# Altium project V2_wearable.PrjPcb
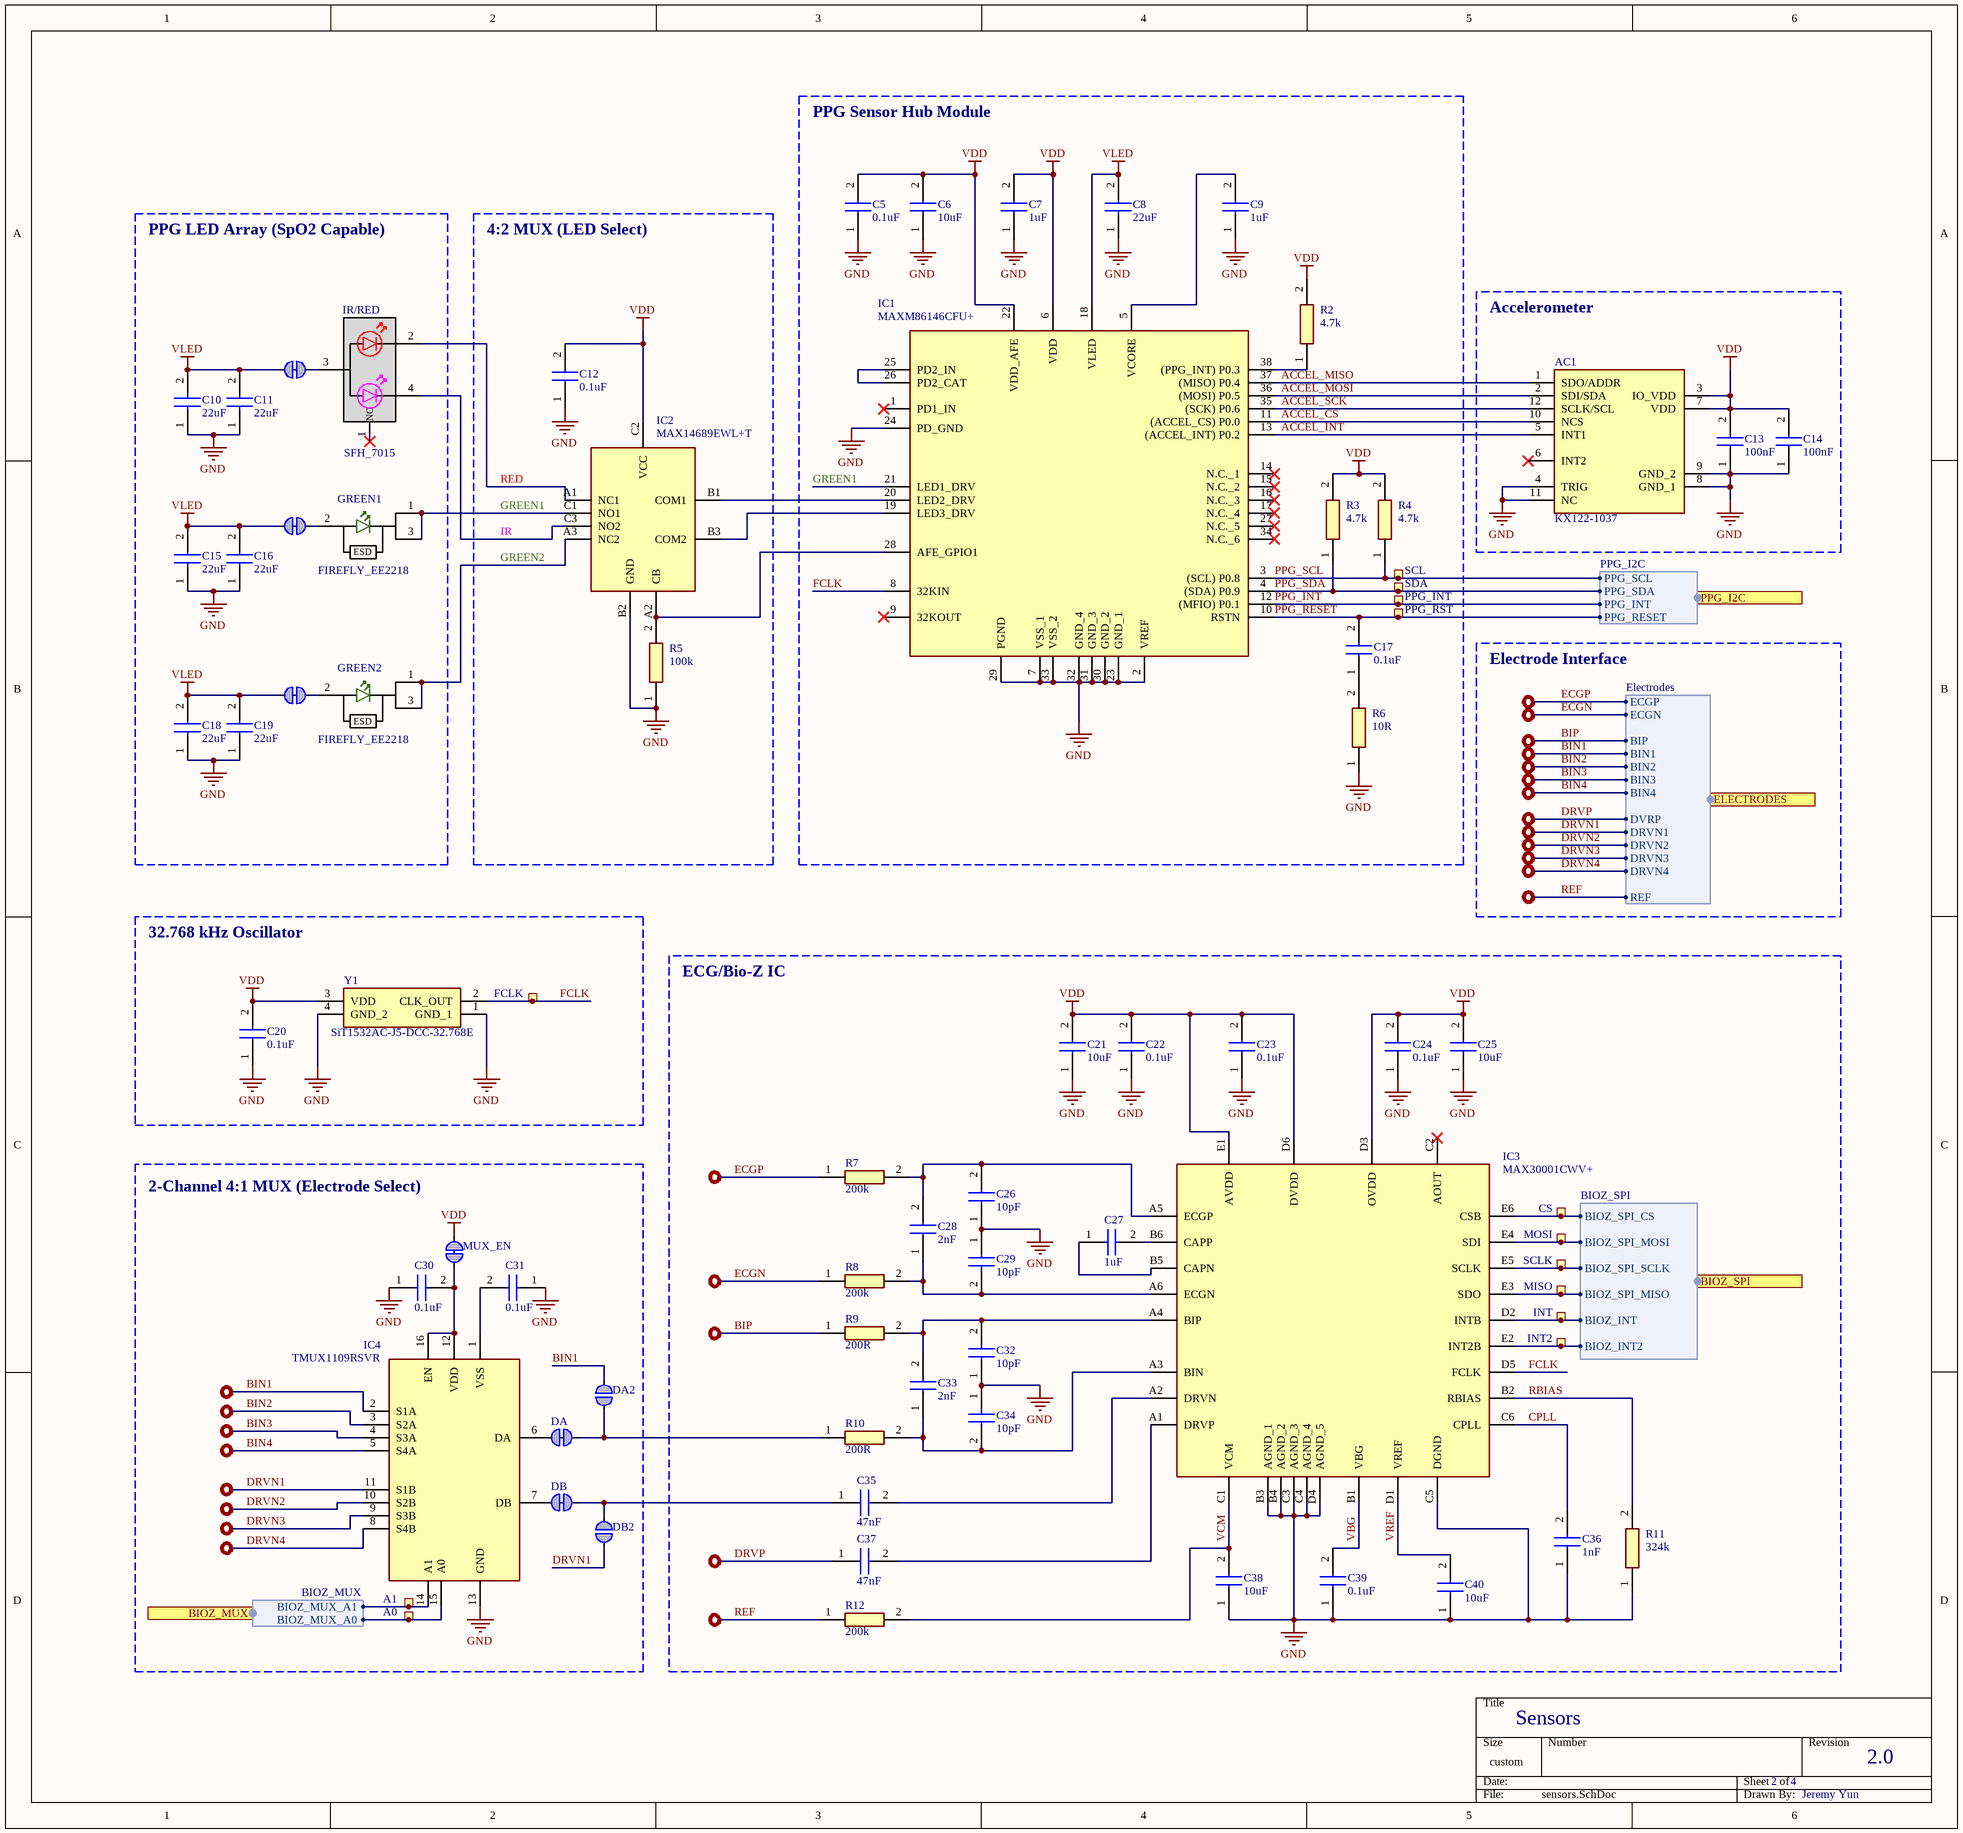
[diagram p0: sensors.SchDoc]
2 sheets, 107 parts. Net scope: flat (ports and power ports of the same name join across sheets).
Board file: ipg_wearable.PcbDoc
Sheets:
  sensors.SchDoc
  power_supply.SchDoc

## Sheet sensors.SchDoc
size 381 x 355 mm; SheetNumber: 2; SheetTotal: 4

### Parts
A0  Ø1.0mm,SMD  [TP_SMD_D1.0mm]  (value not drawn)  (no BOM)
A1  Ø1.0mm,SMD  [TP_SMD_D1.0mm]  (value not drawn)  (no BOM)
AC1  KX122-1037  [KX1221037]
C5  0.1uF  [CAPC1005X55N]
C6  10uF  [CAPC1005X55N]
C7  1uF  [CAPC1005X55N]
C8  22uF  [CAPC1005X55N]
C9  1uF  [CAPC1005X55N]
C10  22uF  [CAPC1005X55N]
C11  22uF  [CAPC1005X55N]
C12  0.1uF  [CAPC1005X55N]
C13  100nF  [CAPC1005X55N]
C14  100nF  [CAPC1005X55N]
C15  22uF  [CAPC1005X55N]
C16  22uF  [CAPC1005X55N]
C17  0.1uF  [CAPC1005X55N]
C18  22uF  [CAPC1005X55N]
C19  22uF  [CAPC1005X55N]
C20  0.1uF  [CAPC1005X55N]
C21  10uF  [CAPC1005X55N]
C22  0.1uF  [CAPC1005X55N]
C23  0.1uF  [CAPC1005X55N]
C24  0.1uF  [CAPC1005X55N]
C25  10uF  [CAPC1005X55N]
C26  10pF  [CAPC0603X33N]
C27  1uF  [CAPC1005X55N]
C28  2nF  [C0603]
C29  10pF  [CAPC0603X33N]
C30  0.1uF  [CAPC1005X55N]
C31  0.1uF  [CAPC1005X55N]
C32  10pF  [CAPC0603X33N]
C33  2nF  [C0603]
C34  10pF  [CAPC0603X33N]
C35  47nF  [CAPC2012X140N]
C36  1nF  [C0402]
C37  47nF  [CAPC2012X140N]
C38  10uF  [CAPC1005X55N]
C39  0.1uF  [CAPC1005X55N]
C40  10uF  [CAPC1005X55N]
CS  Ø1.0mm,SMD  [TP_SMD_D1.0mm]  (value not drawn)  (no BOM)
DA  Solderbridge  [Solderbridge_Shorted]  (value not drawn)  (net tie, no BOM)
DA2  Solderbridge  [Solderbridge]  (value not drawn)  (no BOM)
DB  Solderbridge  [Solderbridge_Shorted]  (value not drawn)  (net tie, no BOM)
DB2  Solderbridge  [Solderbridge]  (value not drawn)  (no BOM)
FCLK  Ø1.0mm,SMD  [TP_SMD_D1.0mm]  (value not drawn)  (no BOM)
GR1  Solderbridge  [Solderbridge_Shorted]  (value not drawn)  (net tie, no BOM)
GR2  Solderbridge  [Solderbridge_Shorted]  (value not drawn)  (net tie, no BOM)
GREEN1  FIREFLY_EE2218  [CTDBLP31126C5D56J6U620R18]
GREEN2  FIREFLY_EE2218  [CTDBLP31126C5D56J6U620R18]
IC1  MAXM86146CFU+  [MAXM86146CFU]
IC2  MAX14689EWL+T  [BGA9C40P3X3_124X124X69]
IC3  MAX30001CWV+  [BGA30C50P6X5_293X274X69]
IC4  TMUX1109RSVR  [TMUX1109RSVR]
INT  Ø1.0mm,SMD  [TP_SMD_D1.0mm]  (value not drawn)  (no BOM)
INT2  Ø1.0mm,SMD  [TP_SMD_D1.0mm]  (value not drawn)  (no BOM)
IR/RED  SFH_7015  [SFH7015]
MISO  Ø1.0mm,SMD  [TP_SMD_D1.0mm]  (value not drawn)  (no BOM)
MOSI  Ø1.0mm,SMD  [TP_SMD_D1.0mm]  (value not drawn)  (no BOM)
MUX_EN  Solderbridge  [Solderbridge_Shorted]  (value not drawn)  (net tie, no BOM)
PPG_INT  Ø1.0mm,SMD  [TP_SMD_D1.0mm]  (value not drawn)  (no BOM)
PPG_RST  Ø1.0mm,SMD  [TP_SMD_D1.0mm]  (value not drawn)  (no BOM)
R2  4.7k  [RESC1005X40N]
R3  4.7k  [RESC1005X40N]
R4  4.7k  [RESC1005X40N]
R5  100k  [RESC1005X40N]
R6  10R  [RESC1005X40N]
R7  200k  [ERJ2RKD1004X]
R8  200k  [ERJ2RKD1004X]
R9  200R  [ERJ2RKD1004X]
R10  200R  [ERJ2RKD1004X]
R11  324k  [RESC1608X55N]
R12  200k  [ERJ2RKD1004X]
RED/IR  Solderbridge  [Solderbridge_Shorted]  (value not drawn)  (net tie, no BOM)
SCL  Ø1.0mm,SMD  [TP_SMD_D1.0mm]  (value not drawn)  (no BOM)
SCLK  Ø1.0mm,SMD  [TP_SMD_D1.0mm]  (value not drawn)  (no BOM)
SDA  Ø1.0mm,SMD  [TP_SMD_D1.0mm]  (value not drawn)  (no BOM)
Y1  SiT1532AC-J5-DCC-32.768E  [SiT1532ACJ5DCC32768E]

### Blocks framed on the sheet
PPG Sensor Hub Module: C5-C9 C17 IC1 PPG_INT PPG_RST R2-R4 R6 SCL SDA
PPG LED Array (SpO2 Capable): C10 C11 C15 C16 C18 C19 GR1 GR2 GREEN1 GREEN2 IR/RED RED/IR
4:2 MUX (LED Select): C12 IC2 R5
Accelerometer: AC1 C13 C14
32.768 kHz Oscillator: C20 FCLK Y1
ECG/Bio-Z IC: C21-C29 C32-C40 CS IC3 INT INT2 MISO MOSI R7-R12 SCLK
2-Channel 4:1 MUX (Electrode Select): A0 A1 C30 C31 DA DA2 DB DB2 IC4 MUX_EN

### Ports
BIOZ_MUX (harness BIOZ_MUX), BIOZ_SPI (harness BIOZ_SPI), ELECTRODES (harness Electrodes), PPG_I2C (harness PPG_I2C)

### Harnesses
Electrodes: ECGP, ECGN, BIN1, BIP, BIN2, BIN3, BIN4, DVRP, DRVN1, DRVN3, DRVN2, DRVN4, REF
BIOZ_SPI: BIOZ_SPI_CS, BIOZ_SPI_MOSI, BIOZ_SPI_MISO, BIOZ_SPI_SCLK, BIOZ_INT, BIOZ_INT2
PPG_I2C: PPG_SCL, PPG_SDA, PPG_INT, PPG_RESET
BIOZ_MUX: BIOZ_MUX_A0, BIOZ_MUX_A1

### Nets
GND: AC1.4(TRIG) AC1.8(GND_1) AC1.9(GND_2) AC1.11(NC) C5.1 C6.1 C7.1 C8.1 C9.1 C10.1 C11.1 C12.1 C13.1 C14.1 C15.1 C16.1 C18.1 C19.1 C20.1 C21.1 C22.1 C23.1 C24.1 C25.1 C26.1 C29.1 C30.1 C31.1 C32.1 C34.1 C36.1 C38.1 C39.1 C40.1 IC1.2(VREF) IC1.7(VSS_1) IC1.23(GND_1) IC1.24(PD_GND) IC1.29(PGND) IC1.30(GND_2) IC1.31(GND_3) IC1.32(GND_4) IC1.33(VSS_2) IC2.B2(GND) IC3.B3(AGND_1) IC3.B4(AGND_2) IC3.C3(AGND_3) IC3.C4(AGND_4) IC3.C5(DGND) IC3.D4(AGND_5) IC4.13(GND) R5.1 R6.1 R11.1 Y1.1(GND_1) Y1.4(GND_2)
VDD: AC1.3(IO_VDD) AC1.7(VDD) C5.2 C6.2 C7.2 C12.2 C13.2 C14.2 C20.2 C21.2 C22.2 C23.2 C24.2 C25.2 IC1.6(VDD) IC1.22(VDD_AFE) IC2.C2(VCC) IC3.D3(OVDD) IC3.D6(DVDD) IC3.E1(AVDD) MUX_EN.1 R2.2 R3.2 R4.2 Y1.3(VDD)
VLED: C8.2 C10.2 C11.2 C15.2 C16.2 C18.2 C19.2 GR1.1 GR2.1 IC1.18(VLED) RED/IR.1
ACCEL_CS: AC1.10(NCS) IC1.11((ACCEL_CS)_P0.0)
ACCEL_INT: AC1.5(INT1) IC1.13((ACCEL_INT)_P0.2)
ACCEL_MISO: AC1.1(SDO/ADDR) IC1.37((MISO)_P0.4)
ACCEL_MOSI: AC1.2(SDI/SDA) IC1.36((MOSI)_P0.5)
ACCEL_SCK: AC1.12(SCLK/SCL) IC1.35((SCK)_P0.6)
BIN1: DA2.1 IC4.2(S1A) ; port ELECTRODES.BIN1
BIN2: IC4.3(S2A) ; port ELECTRODES.BIN2
BIN3: IC4.4(S3A) ; port ELECTRODES.BIN3
BIN4: IC4.5(S4A) ; port ELECTRODES.BIN4
BIP: R9.1 ; port ELECTRODES.BIP
CPLL: C36.2 IC3.C6(CPLL)
DRVN1: DB2.2 IC4.11(S1B) ; port ELECTRODES.DRVN1
DRVN2: IC4.10(S2B) ; port ELECTRODES.DRVN2
DRVN3: IC4.9(S3B) ; port ELECTRODES.DRVN3
DRVN4: IC4.8(S4B) ; port ELECTRODES.DRVN4
DRVP: C37.1 ; port ELECTRODES.DVRP
ECGN: R8.1 ; port ELECTRODES.ECGN
ECGP: R7.1 ; port ELECTRODES.ECGP
FCLK: FCLK.1 IC1.8(32KIN) IC3.D5(FCLK) Y1.2(CLK_OUT)
GREEN1: GREEN1.1(K_1) GREEN1.3(K_2) IC1.21(LED1_DRV) IC2.C1(NO1)
GREEN2: GREEN2.1(K_1) GREEN2.3(K_2) IC2.A3(NC2)
IR: IC2.C3(NO2) IR/RED.4(CATHODE_EMITTER_2_(940_NM))
PPG_INT: IC1.12((MFIO)_P0.1) PPG_INT.1 ; port PPG_I2C.PPG_INT
PPG_RESET: C17.2 IC1.10(RSTN) PPG_RST.1 ; port PPG_I2C.PPG_RESET
PPG_SCL: IC1.3((SCL)_P0.8) R4.1 SCL.1 ; port PPG_I2C.PPG_SCL
PPG_SDA: IC1.4((SDA)_P0.9) R3.1 SDA.1 ; port PPG_I2C.PPG_SDA
RBIAS: IC3.B2(RBIAS) R11.2
RED: IC2.A1(NC1) IR/RED.2(CATHODE_EMITTER_1_(655_NM))
REF: R12.1 ; port ELECTRODES.REF
VBG: C39.2 IC3.B1(VBG)
VCM: C38.2 IC3.C1(VCM) R12.2
VREF: C40.2 IC3.D1(VREF)
NetA0_1: A0.1 IC4.15(A0) ; port BIOZ_MUX.BIOZ_MUX_A0
NetA1_1: A1.1 IC4.14(A1) ; port BIOZ_MUX.BIOZ_MUX_A1
NetC9_2: C9.2 IC1.5(VCORE)
NetC17_1: C17.1 R6.2
NetC26_2: C26.2 C28.2 IC3.A5(ECGP) R7.2
NetC27_1: C27.1 IC3.B5(CAPN)
NetC27_2: C27.2 IC3.B6(CAPP)
NetC28_1: C28.1 C29.2 IC3.A6(ECGN) R8.2
NetC30_2: C30.2 IC4.12(VDD) IC4.16(EN) MUX_EN.2
NetC31_2: C31.2 IC4.1(VSS)
NetC32_2: C32.2 C33.2 IC3.A4(BIP) R9.2
NetC33_1: C33.1 C34.2 IC3.A3(BIN) R10.2
NetC35_1: C35.1 DB.1 DB2.1
NetC35_2: C35.2 IC3.A2(DRVN)
NetC37_2: C37.2 IC3.A1(DRVP)
NetCS_1: CS.1 IC3.E6(CSB) ; port BIOZ_SPI.BIOZ_SPI_CS
NetDA_1: DA.1 DA2.2 R10.1
NetDA_2: DA.2 IC4.6(DA)
NetDB_2: DB.2 IC4.7(DB)
NetGR1_2: GR1.2 GREEN1.2(A)
NetGR2_2: GR2.2 GREEN2.2(A)
NetIC1_19: IC1.19(LED3_DRV) IC2.B3(COM2)
NetIC1_20: IC1.20(LED2_DRV) IC2.B1(COM1)
NetIC1_25: IC1.25(PD2_IN) IC1.26(PD2_CAT)
NetIC1_28: IC1.28(AFE_GPIO1) IC2.A2(CB) R5.2
NetIC1_38: IC1.38((PPG_INT)_P0.3) R2.1
NetIC3_D2: IC3.D2(INTB) INT.1 ; port BIOZ_SPI.BIOZ_INT
NetIC3_E2: IC3.E2(INT2B) INT2.1 ; port BIOZ_SPI.BIOZ_INT2
NetIC3_E3: IC3.E3(SDO) MISO.1 ; port BIOZ_SPI.BIOZ_SPI_MISO
NetIC3_E4: IC3.E4(SDI) MOSI.1 ; port BIOZ_SPI.BIOZ_SPI_MOSI
NetIC3_E5: IC3.E5(SCLK) SCLK.1 ; port BIOZ_SPI.BIOZ_SPI_SCLK
NetIR/RED_3: IR/RED.3(A) RED/IR.2

Not connected (* = marked no-connect by the designer): AC1 6(INT2)*; IC1 1(PD1_IN)* 9(32KOUT)* 14(N.C._1)* 15(N.C._2)* 16(N.C._3)* 17(N.C._4)* 27(N.C._5)* 34(N.C._6)*; IC3 C2(AOUT)*; IR/RED 1(NC)*

### Notes on the sheet
- Electrode Interface
- Sensors
- 2
- 4
- 2.0
- Jeremy Yun
- (in symbol CT_DBLP31.12-6C5D-56-J6U6-20-R18) ESD

### Library data of the parts
A0 A1 CS FCLK INT INT2 MISO MOSI PPG_INT PPG_RST SCL SCLK SDA = TP_SMD_Ø1.0MM: 1.0mm circular SMD testpad; Manufacturer: Nordic Semiconductor; Manufacturer Part Number: N.A.; Pad Count: 1; Part Number: TP_SMD_Ø1.0MM; LatestRevisionDate: 2021-03-05; Pin Count: 1; Publisher: Nordic Semiconductor; Published: 2013-06-11; Value: Ø1.0mm,SMD; Note: N.A.; Artikkelnr Noca: N.A.; Footprint Doc: TP_SMD_Ø1.0mm; Part number IPS: N.A.; ComponentLink1URL: N.A.; ComponentLink1Description: Datasheet; ComponentLink2URL: N.A.; ComponentLink2Description: Supplier link; HelpURL: N.A.; Supplier 1: N.A.; Supplier Part Number 1: N.A.; Supplier 2: N.A.; Supplier Part Number 2: N.A.; Author: rsk; Component Class: Connectors; PartId: 100500475; Part number Norautron: N.A.
AC1 = KX122-1037: Accelerometer; Manufacturer_Name: Kionix; Datasheet Link: https://kionixfs.azureedge.net/en/document/TN008-PCB-Design-Guidelines-for-2x2-LGA-Sensors.pdf; Height: 1mm; Manufacturer_Part_Number: KX122-1037; Mouser Part Number: 912-KX122-1037; Mouser Price/Stock: https://www.mouser.co.uk/ProductDetail/Kionix/KX122-1037?qs=6OIXIgk3fwdhApAbA9esZQ%3D%3D
C5 C12 C17 C20 C22-C24 C30 C31 C39 = GRM155R71C104KA88D: Capacitor; Manufacturer_Name: Murata Electronics; Datasheet Link: http://www.murata.com/~/media/webrenewal/support/library/catalog/products/capacitor/mlcc/c02e.pdf; Height: 0.55mm; Manufacturer_Part_Number: GRM155R71C104KA88D; Mouser Part Number: N/A; Arrow Part Number: GRM155R71C104KA88D; Arrow Price/Stock: https://www.arrow.com/en/products/grm155r71c104ka88d/murata-manufacturing?region=nac
C6 C21 C25 C38 C40 = GRM155R60J106ME05D: Capacitor 10uF X5R Ceramic; Manufacturer_Name: Murata Electronics; Datasheet Link: http://www.murata.com/~/media/webrenewal/support/library/catalog/products/capacitor/mlcc/c02e.pdf; Height: 0.55mm; Manufacturer_Part_Number: GRM155R60J106ME05D; Mouser Part Number: 81-GRM155R60J106M05D; Mouser Price/Stock: https://www.mouser.co.uk/ProductDetail/Murata-Electronics/GRM155R60J106ME05D?qs=d0WKAl%252BL4KYEzZPQ8Lkwdw%3D%3D; Arrow Part Number: GRM155R60J106ME05D; Arrow Price/Stock: https://www.arrow.com/en/products/grm155r60j106me05d/murata-manufacturing?region=nac
C7 C9 C27 = CL05B104KP5NNNC: Capacitor; Manufacturer_Name: SAMSUNG; Datasheet Link: http://product.samsungsem.com/mlcc/CL05B104KP5NNN.do; Height: 0.55mm; Manufacturer_Part_Number: CL05B104KP5NNNC; Mouser Part Number: 187-CL05B104KP5NNNC; Mouser Price/Stock: https://www.mouser.co.uk/ProductDetail/Samsung-Electro-Mechanics/CL05B104KP5NNNC?qs=349EhDEZ59qDkVTTBSSSxw%3D%3D; Arrow Part Number: CL05B104KP5NNNC; Arrow Price/Stock: https://www.arrow.com/en/products/cl05b104kp5nnnc/samsung-electro-mechanics?region=nac
C8 C10 C11 C15 C16 C18 C19 = CL05B224KO5NNNC: Capacitor; Manufacturer_Name: SAMSUNG; Datasheet Link: https://media.digikey.com/pdf/Data%20Sheets/Samsung%20PDFs/CL05B224KO5NNNC_Spec.pdf; Height: 0.55mm; Manufacturer_Part_Number: CL05B224KO5NNNC; Mouser Part Number: 187-CL05B224KO5NNNC; Mouser Price/Stock: https://www.mouser.co.uk/ProductDetail/Samsung-Electro-Mechanics/CL05B224KO5NNNC?qs=X6jEic%2FHinCN6V6mK7LtLg%3D%3D; Arrow Part Number: CL05B224KO5NNNC; Arrow Price/Stock: https://www.arrow.com/en/products/cl05b224ko5nnnc/samsung-electro-mechanics
C13 C14 = CL05B104KP5VPNC: Capacitor; Manufacturer_Name: SAMSUNG; Datasheet Link: https://product.samsungsem.com/mlcc/CL05B104KP5VPN.do; Height: 0.55mm; Manufacturer_Part_Number: CL05B104KP5VPNC; Mouser Part Number: 187-CL05B104KP5VPNC; Mouser Price/Stock: https://www.mouser.co.uk/ProductDetail/Samsung-Electro-Mechanics/CL05B104KP5VPNC?qs=gqBM4hNBiUXTv%252BkFO9q2pQ%3D%3D
C26 C29 C32 C34 = GRM0335C1E100JA01D: Capacitor; Manufacturer_Name: Murata Electronics; Datasheet Link: http://www.murata.com/~/media/webrenewal/support/library/catalog/products/capacitor/mlcc/c02e.pdf; Height: 0.33mm; Manufacturer_Part_Number: GRM0335C1E100JA01D; Mouser Part Number: 81-GRM0335C1E100JA1D; Mouser Price/Stock: https://www.mouser.co.uk/ProductDetail/Murata-Electronics/GRM0335C1E100JA01D?qs=3ZwS9AhGA%2F61ULaWXbLsuw%3D%3D; Arrow Part Number: GRM0335C1E100JA01D; Arrow Price/Stock: https://www.arrow.com/en/products/grm0335c1e100ja01d/murata-manufacturing?region=nac
C28 C33 = C0603C202G4HACAUTO: Capacitor; Manufacturer_Name: KEMET; Datasheet Link: https://content.kemet.com/datasheets/KEM_C1007_X8R_ULTRA_150C_SMD.pdf; Height: 0.87mm; Manufacturer_Part_Number: C0603C202G4HACAUTO
C35 C37 = C0805C473K1RECAUTO7210: Capacitor; Manufacturer_Name: KEMET; Datasheet Link: https://connect.kemet.com:7667/gateway/IntelliData-ComponentDocumentation/1.0/download/specsheet/C0805C473K1RECAUTO7210; Height: 1.4mm; Manufacturer_Part_Number: C0805C473K1RECAUTO7210; Mouser Part Number: 80-C0805C473K1REAULR; Mouser Price/Stock: https://www.mouser.com/Search/Refine.aspx?Keyword=80-C0805C473K1REAULR
C36 = C0402C102J1GEC7411: Capacitor; Manufacturer_Name: KEMET; Datasheet Link: https://content.kemet.com/datasheets/KEM_C1091_C0G_ESD.pdf; Height: 0.55mm; Manufacturer_Part_Number: C0402C102J1GEC7411; Mouser Part Number: 80-C0402C102J1GECLR; Mouser Price/Stock: https://www.mouser.co.uk/ProductDetail/KEMET/C0402C102J1GEC7411?qs=55YtniHzbhDbMp4X17Pi5A%3D%3D
DA DB GR1 GR2 MUX_EN RED/IR = Solderbridge Shorted: Shorted Solderbridge; Manufacturer: N.A.; Pad Count: 2; Part Number: Solderbridge Shorted; Manufacturer Part Number: N.A.; LatestRevisionDate: 2012-08-07; Pin Count: 2; Publisher: Nordic Semiconductor; Published: 2012-08-07; Value: Solderbridge; Note: N.A.; Artikkelnr Noca: N.A.; Footprint Doc: Solderbridge_Shorted; Part number IPS: N.A.; ComponentLink1URL: N.A.; ComponentLink1Description: Datasheet; ComponentLink2URL: N.A.; ComponentLink2Description: Supplier link; HelpURL: N.A.; Supplier 1: N.A.; Supplier Part Number 1: N.A.; Supplier 2: N.A.; Supplier Part Number 2: N.A.; Author: rsk; Component Class: Connectors; PartId: 100500459; Part number Norautron: N.A.
DA2 DB2 = Solderbridge: Manufacturer: N.A.; Pad Count: 2; Part Number: Solderbridge; Manufacturer Part Number: N.A.; LatestRevisionDate: 2009-12-14; Pin Count: 2; Publisher: Nordic Semiconductor; Published: 2009-12-14; Value: Solderbridge; Note: N.A.; Artikkelnr Noca: N.A.; Footprint Doc: Solderbridge; Part number IPS: N.A.; ComponentLink1URL: N.A.; ComponentLink1Description: Datasheet; ComponentLink2URL: N.A.; ComponentLink2Description: Supplier link; HelpURL: N.A.; Supplier 1: N.A.; Supplier Part Number 1: N.A.; Supplier 2: N.A.; Supplier Part Number 2: N.A.; Author: rsk; Component Class: Connectors; PartId: 100500458; Part number Norautron: N.A.
GREEN1 GREEN2 = CT_DBLP31.12-6C5D-56-J6U6-20-R18: LED; Manufacturer_Name: ams OSRAM; Manufacturer_Part_Number: CT DBLP31.12-6C5D-56-J6U6-20-R18; Datasheet Link: https://www.mouser.com/catalog/specsheets/Osram-03-25-2019-CT%20DBLP31.12_EN.pdf; Mouser Part Number: 720-CTDBLP31A6091; Mouser Price/Stock: https://www.mouser.co.uk/ProductDetail/OSRAM-Opto-Semiconductors/CT-DBLP3112-6C5D-56-J6U6-20-R18?qs=vLWxofP3U2xgbqKYEOstuw%3D%3D
IC1 = MAXM86146CFU+: Integrated Circuit; Manufacturer_Name: Analog Devices; Datasheet Link: https://datasheets.maximintegrated.com/en/ds/MAXM86146.pdf; Height: 0.975mm; Manufacturer_Part_Number: MAXM86146CFU+; Mouser Part Number: 700-MAXM86146CFU+; Mouser Price/Stock: https://www.mouser.co.uk/ProductDetail/Analog-Devices-Maxim-Integrated/MAXM86146CFU%2b?qs=7MVldsJ5UaxGg5O5mFC%252Bgg%3D%3D
IC2 = MAX14689EWL+T: Integrated Circuit; Manufacturer_Name: Analog Devices; Datasheet Link: https://datasheets.maximintegrated.com/en/ds/MAX14689.pdf; Height: 0.69mm; Manufacturer_Part_Number: MAX14689EWL+T; Mouser Part Number: 700-MAX14689EWL+T; Mouser Price/Stock: https://www.mouser.co.uk/ProductDetail/Maxim-Integrated/MAX14689EWL%2bT?qs=jKHy77vQLH2WsIix%2FYfctQ%3D%3D
IC3 = MAX30001CWV+: Integrated Circuit; Manufacturer_Name: Analog Devices; Datasheet Link: https://datasheets.maximintegrated.com/en/ds/MAX30001.pdf; Height: 0.69mm; Manufacturer_Part_Number: MAX30001CWV+; Mouser Part Number: 700-MAX30001CWV+; Mouser Price/Stock: https://www.mouser.co.uk/ProductDetail/Analog-Devices-Maxim-Integrated/MAX30001CWV%2b?qs=gt1LBUVyoHlQ9wjGIPyD2Q%3D%3D
IC4 = TMUX1109RSVR: Integrated Circuit; Manufacturer_Name: Texas Components; Datasheet Link: https://www.ti.com/lit/ds/symlink/tmux1109.pdf?ts=1635353641443&ref_url=https%253A%252F%252Fwww.ti.com%252Fswitches-multiplexers%252Fanalog%252Fproducts.html; Height: 0.55mm; Manufacturer_Part_Number: TMUX1109RSVR
IR/RED = SFH_7015: LED; Manufacturer_Name: ams OSRAM; Datasheet Link: https://www.osram.com/ecat/CHIPLED%C2%AE%20SFH%207015/com/en/class_pim_web_catalog_103489/global/prd_pim_device_6573079/; Height: 0.7mm; Manufacturer_Part_Number: SFH 7015; Mouser Part Number: 720-SFH7015; Mouser Price/Stock: https://www.mouser.co.uk/ProductDetail/OSRAM-Opto-Semiconductors/SFH-7015?qs=OTrKUuiFdkbk%2F%252BQNXT%2FkUA%3D%3D; Arrow Part Number: SFH 7015; Arrow Price/Stock: https://www.arrow.com/en/products/sfh-7015/osram-opto-semiconductors?region=nac
R2-R4 = RC0402FR-074K7L: Resistor; Manufacturer_Name: KEMET; Datasheet Link: http://www.yageo.com/documents/recent/PYu-RC0402_51_RoHS_L_6_r.pdf; Height: 0.4mm; Manufacturer_Part_Number: RC0402FR-074K7L; Mouser Part Number: 603-RC0402FR-074K7L; Mouser Price/Stock: https://www.mouser.co.uk/ProductDetail/YAGEO/RC0402FR-074K7L?qs=V1yeUXFNrkn%2FmCXC8N8TTA%3D%3D; Arrow Part Number: RC0402FR-074K7L; Arrow Price/Stock: https://www.arrow.com/en/products/rc0402fr-074k7l/yageo
R5 = RC0402FR-07100KL: Resistor; Manufacturer_Name: YAGEO; Datasheet Link: https://componentsearchengine.com/Datasheets/2/RC0402FR-07100KL.pdf; Height: 0.4mm; Manufacturer_Part_Number: RC0402FR-07100KL; Mouser Part Number: 603-RC0402FR-07100KL; Mouser Price/Stock: https://www.mouser.co.uk/ProductDetail/YAGEO/RC0402FR-07100KL?qs=mnq%2FyloZIXzTlUn7JAHSWg%3D%3D; Arrow Part Number: RC0402FR-07100KL; Arrow Price/Stock: https://www.arrow.com/en/products/rc0402fr-07100kl/yageo?region=europe
R6 = RC0402FR-0710RL: Resistor; Manufacturer_Name: KEMET; Datasheet Link: http://www.yageo.com/documents/recent/PYu-RC0402_51_RoHS_L_6_r.pdf; Height: 0.4mm; Manufacturer_Part_Number: RC0402FR-0710RL; Mouser Part Number: 603-RC0402FR-0710RL; Mouser Price/Stock: https://www.mouser.co.uk/ProductDetail/YAGEO/RC0402FR-0710RL?qs=V1yeUXFNrkkzkWCUUWS9og%3D%3D
R7 R8 R12 = ERJ-2RKF2003X: Resistor; Manufacturer_Name: Panasonic; Datasheet Link: https://industrial.panasonic.com/cdbs/www-data/pdf/RDA0000/AOA0000C86.pdf; Height: 0.4mm; Manufacturer_Part_Number: ERJ-2RKF2003X; Mouser Part Number: 667-ERJ-2RKF2003X; Mouser Price/Stock: https://www.mouser.co.uk/ProductDetail/Panasonic/ERJ-2RKF2003X?qs=H7k1u0Mp9JQs7qWHNZeKxQ%3D%3D; Arrow Part Number: ERJ-2RKF2003X; Arrow Price/Stock: https://www.arrow.com/en/products/erj2rkf2003x/panasonic?region=europe
R9 R10 = ERJ-2RKF2000X: Resistor; Manufacturer_Name: Panasonic; Datasheet Link: https://industrial.panasonic.com/cdbs/www-data/pdf/RDA0000/AOA0000C86.pdf; Height: 0.4mm; Manufacturer_Part_Number: ERJ-2RKF2000X; Mouser Part Number: 667-ERJ-2RKF2000X; Mouser Price/Stock: https://www.mouser.co.uk/ProductDetail/Panasonic/ERJ-2RKF2000X?qs=P9MxuNjgFLMhlpyylwMTwg%3D%3D; Arrow Part Number: ERJ-2RKF2000X; Arrow Price/Stock: https://www.arrow.com/en/products/erj-2rkf2000x/panasonic?region=nac
R11 = RN73C1J324KBTDF: Resistor; Manufacturer_Name: TE Connectivity; Datasheet Link: https://componentsearchengine.com/Datasheets/2/RN73C1J324KBTDF.pdf; Height: 0.55mm; Manufacturer_Part_Number: RN73C1J324KBTDF; Mouser Part Number: 279-RN73C1J324KBTDF; Mouser Price/Stock: https://www.mouser.co.uk/ProductDetail/TE-Connectivity-Holsworthy/RN73C1J324KBTDF?qs=8G8kQhBkhGjA96pes7zqwA%3D%3D
Y1 = SiT1532AC-J5-DCC-32.768E: Crystal or Oscillator; Manufacturer_Name: SiTime; Datasheet Link: https://www.sitime.com/support/resource-library/datasheets/sit1532-datasheet; Height: 0.6mm; Manufacturer_Part_Number: SiT1532AC-J5-DCC-32.768E; Mouser Part Number: 788-1532ACJ5DCC32.7E; Mouser Price/Stock: https://www.mouser.co.uk/ProductDetail/SiTime/SiT1532AC-J5-DCC-32768E?qs=dMZC7um9hO%252BBGGNkRGdGlw%3D%3D; Arrow Part Number: SIT1532AC-J5-DCC-32.768E; Arrow Price/Stock: https://www.arrow.com/en/products/sit1532ac-j5-dcc-32.768e/sitime?region=nac

## Sheet power_supply.SchDoc
size A; SheetNumber: 4; SheetTotal: 4
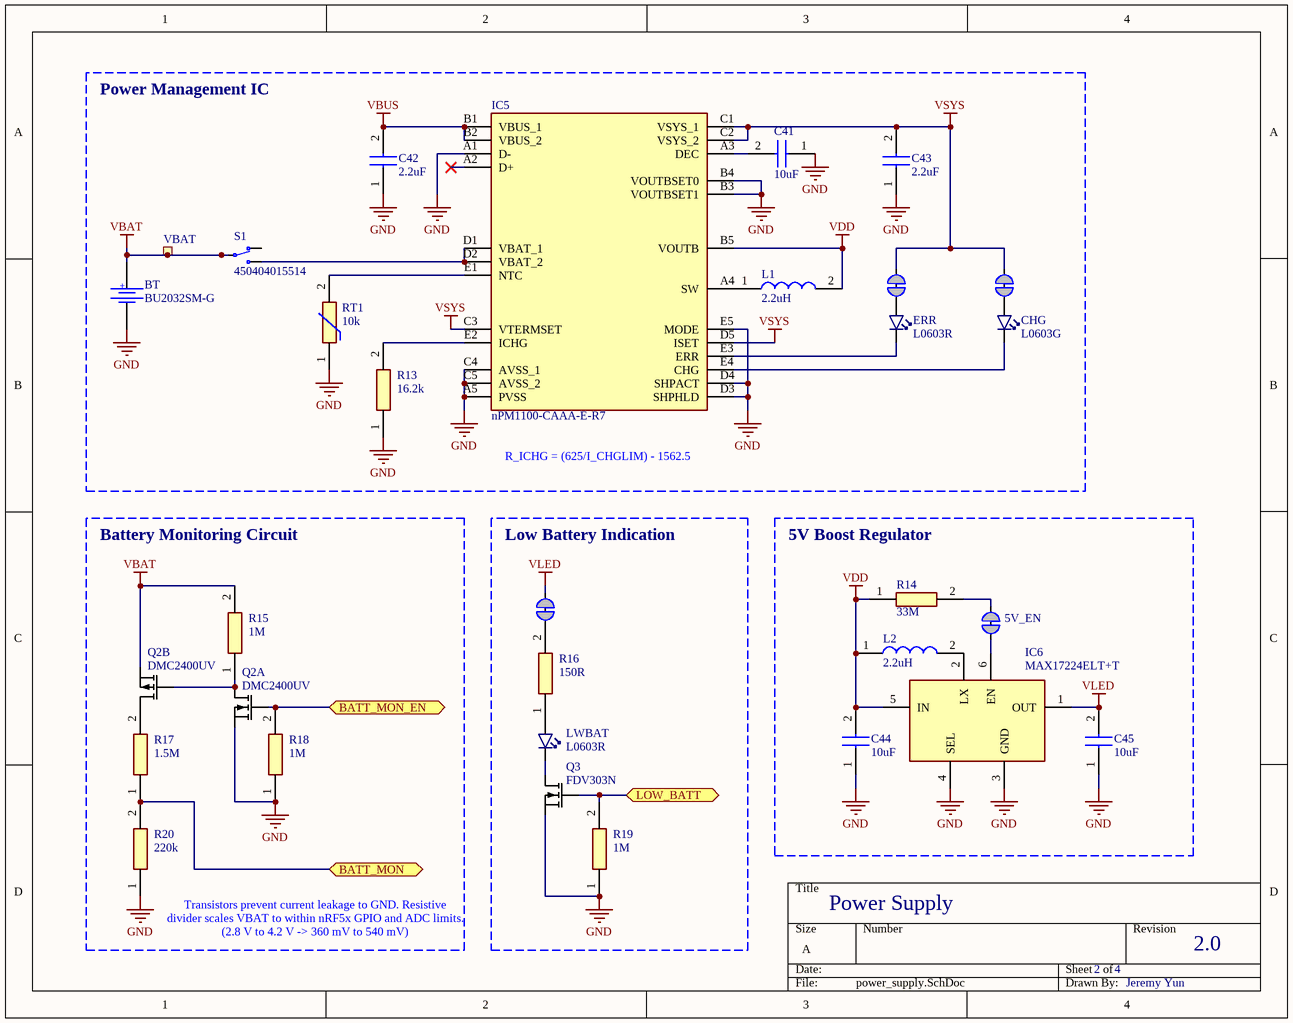
[diagram p1: power_supply.SchDoc]

### Parts
5V_EN  Solderbridge  [Solderbridge_Shorted]  (value not drawn)  (net tie, no BOM)
BT  BU2032SM-G  [BAT_BU2032SM-G]
C41  10uF  [CAPC1005X55N]
C42  2.2uF  [CAPC0603X33N]
C43  2.2uF  [CAPC0603X33N]
C44  10uF  [CAPC1005X55N]
C45  10uF  [CAPC1005X55N]
CHG  L0603G  [LED_0603_G]
ERR  L0603R  [LEDC1608X80N]
IC5  nPM1100-CAAA-E-R7  [BGA25C40P5X5_208X208X52]
IC6  MAX17224ELT+T  [MAX17224ELTT]
L1  2.2uH  [DFE201210S1R0MP2]
L2  2.2uH  [LQM2HPZ3R3MJ0B]
LWBAT  L0603R  [LEDC1608X80N]
Q2  DMC2400UV  [SOTFL50P162X60-6N]  (parts A,B of 2)
Q3  FDV303N  [SOT96P237X111-3N]
R13  16.2k  [RESC1608X55N]
R14  33M  [RESC1005X40N]
R15  1M  [RESC1608X55N]
R16  150R  [ERJ2RKD1004X]
R17  1.5M  [ERJ2RKD1004X]
R18  1M  [RESC1608X55N]
R19  1M  [RESC1608X55N]
R20  220k  [ERJ2RKD1004X]
RT1  10k  [ERTJZEG103FA]
S1  450404015514  [450404015514]
SB9  Solderbridge  [Solderbridge_Shorted]  (value not drawn)  (net tie, no BOM)
SB10  Solderbridge  [Solderbridge_Shorted]  (value not drawn)  (net tie, no BOM)
SB15  Solderbridge  [Solderbridge_Shorted]  (value not drawn)  (net tie, no BOM)
VBAT  Ø1.0mm,SMD  [TP_SMD_D1.0mm]  (value not drawn)  (no BOM)

### Blocks framed on the sheet
Power Management IC: BT C41-C43 CHG ERR IC5 L1 R13 RT1 S1 SB9 SB10 VBAT
Battery Monitoring Circuit: Q2 R15 R17 R18 R20
Low Battery Indication: LWBAT Q3 R16 R19 SB15
5V Boost Regulator: 5V_EN C44 C45 IC6 L2 R14

### Ports
BATT_MON (bidir), BATT_MON_EN (bidir), LOW_BATT (bidir)

### Nets
GND: BT.NEG C41.1 C42.1 C43.1 C44.1 C45.1 IC5.A1(D-) IC5.A5(PVSS) IC5.B3(VOUTBSET1) IC5.B4(VOUTBSET0) IC5.C4(AVSS_1) IC5.C5(AVSS_2) IC5.D3(SHPHLD) IC5.D4(SHPACT) IC5.E5(MODE) IC6.3(GND) IC6.4(SEL) Q2.1(S1) Q3.2(S) R13.1 R18.1 R19.1 R20.1 RT1.1
VBAT: BT.POS Q2.4(S2) R15.2 S1.2(COM-1) VBAT.1
VBUS: C42.2 IC5.B1(VBUS_1) IC5.B2(VBUS_2)
VDD: C44.2 IC5.B5(VOUTB) IC6.5(IN) L1.2 L2.1 R14.1
VLED: C45.2 IC6.1(OUT) SB15.2
VSYS: C43.2 IC5.C1(VSYS_1) IC5.C2(VSYS_2) IC5.C3(VTERMSET) IC5.D5(ISET) SB9.2 SB10.2
Net5V_EN_1: 5V_EN.1 IC6.6(EN)
Net5V_EN_2: 5V_EN.2 R14.2
NetC41_2: C41.2 IC5.A3(DEC)
NetCHG_1: CHG.1(C) IC5.E4(CHG)
NetCHG_2: CHG.2(A) SB10.1
NetERR_1: ERR.1(C) IC5.E3(ERR)
NetERR_2: ERR.2(A) SB9.1
NetIC5_A4: IC5.A4(SW) L1.1
NetIC5_D1: IC5.D1(VBAT_1) IC5.D2(VBAT_2) S1.1(N.O-1)
NetIC5_E1: IC5.E1(NTC) RT1.2
NetIC5_E2: IC5.E2(ICHG) R13.2
NetIC6_2: IC6.2(LX) L2.2
NetLWBAT_1: LWBAT.1(C) Q3.3(D)
NetLWBAT_2: LWBAT.2(A) R16.1
NetQ2_2: Q2.2(G1) R18.2 ; port BATT_MON_EN
NetQ2_3: Q2.3(D2) R17.2
NetQ2_5: Q2.5(G2) Q2.6(D1) R15.1
NetQ3_1: Q3.1(G) R19.2 ; port LOW_BATT
NetR16_2: R16.2 SB15.1
NetR17_1: R17.1 R20.2 ; port BATT_MON

Not connected (* = marked no-connect by the designer): IC5 A2(D+)*; S1 3(N.C-1)

### Notes on the sheet
- R_ICHG = (625/I_CHGLIM) - 1562.5
- Power Supply
- (near R20) Transistors prevent current leakage to GND. Resistive divider scales VBAT to within nRF5x GPIO and ADC limits. (2.8 V to 4.2 V -> 360 mV to 540 mV)
- 2
- 4
- 2.0
- Jeremy Yun
- (in symbol BU2032SM-G) +

### Library data of the parts
5V_EN SB9 SB10 SB15 = Solderbridge Shorted: as DA on sheet sensors; Part Number: Solderbridge Shorted; Manufacturer Part Number: N.A.; LatestRevisionDate: 2012-08-07; Pin Count: 2; Publisher: Nordic Semiconductor; Published: 2012-08-07; Value: Solderbridge; Note: N.A.; Artikkelnr Noca: N.A.; Footprint Doc: Solderbridge_Shorted; Part number IPS: N.A.; ComponentLink1URL: N.A.; ComponentLink1Description: Datasheet; ComponentLink2URL: N.A.; ComponentLink2Description: Supplier link; HelpURL: N.A.; Supplier 1: N.A.; Supplier Part Number 1: N.A.; Supplier 2: N.A.; Supplier Part Number 2: N.A.; Author: rsk; Component Class: Connectors; PartId: 100500459; Part number Norautron: N.A.
BT = BU2032SM-G: BATTERY HOLDER COIN 20MM SMD; MF: MPD; MP: BU2032SM-G; Package: None; Availability: Unavailable; Price: None; SnapEDA_Link: https://www.snapeda.com/parts/BU2032SM-G/Memory%20Protection%20Devices/view-part/4219599/?ref=snap; Value: *
C41 C44 C45 = GRM155R60J106ME05D: as C6 on sheet sensors; Datasheet Link: http://www.murata.com/~/media/webrenewal/support/library/catalog/products/capacitor/mlcc/c02e.pdf; Height: 0.55mm; Manufacturer_Part_Number: GRM155R60J106ME05D; Mouser Part Number: 81-GRM155R60J106M05D; Mouser Price/Stock: https://www.mouser.co.uk/ProductDetail/Murata-Electronics/GRM155R60J106ME05D?qs=d0WKAl%252BL4KYEzZPQ8Lkwdw%3D%3D; Arrow Part Number: GRM155R60J106ME05D; Arrow Price/Stock: https://www.arrow.com/en/products/grm155r60j106me05d/murata-manufacturing?region=nac
C42 C43 = GRM033R60J225ME47D: Capacitor; Manufacturer_Name: Murata Electronics; Datasheet Link: http://www.murata.com/~/media/webrenewal/support/library/catalog/products/capacitor/mlcc/c02e.pdf; Height: 0.33mm; Manufacturer_Part_Number: GRM033R60J225ME47D; Mouser Part Number: 81-GRM033R60J225ME7D; Mouser Price/Stock: https://www.mouser.co.uk/ProductDetail/Murata-Electronics/GRM033R60J225ME47D?qs=kRS0rR9cfpW%252Btpdb3iqxoA%3D%3D; Arrow Part Number: GRM033R60J225ME47D; Arrow Price/Stock: https://www.arrow.com/en/products/grm033r60j225me47d/murata-manufacturing
CHG = VS 25C7M5: LED, Green, 0603, 573nm, Vf=2.0V, 24mcd, - 40 to +85°C; Manufacturer: Victory Electronics; Part number IPS: 00000001274, 00000009961; Note: N.A.; Artikkelnr Noca: 13019193; Pad Count: 2; Part Number: VS 25C7M5; Manufacturer Part Number: VS 25C7M5; Footprint Doc: 0603; LatestRevisionDate: 2020-10-23; Published: 2017-08-21; Value: L0603G; ComponentLink1URL: N.A.; ComponentLink1Description: Datasheet; ComponentLink2URL: N.A.; ComponentLink2Description: Supplier link; HelpURL: \\hizz\pro\app9717\Datasheet\optoelectronics\Victory Electronics\VS 25C7M5.pdf; Supplier 1: EC Partner; Supplier Part Number 1: N.A.; Supplier 2: N.A.; Supplier Part Number 2: N.A.; PartId: 101400097; Component Class: Optoelectronics; Author: rsk; Part number Norautron: N.A.
ERR LWBAT = LS_Q976-NR-1: LED; Manufacturer_Name: ams OSRAM; Manufacturer_Part_Number: LS Q976-NR-1; Datasheet Link: https://datasheet.datasheetarchive.com/originals/distributors/DKDS41/DSANUWW0036602.pdf; Height: 0.8mm; Mouser Part Number: 720-LSQ976-NR-1; Mouser Price/Stock: https://www.mouser.co.uk/ProductDetail/ams-OSRAM/LS-Q976-NR-1?qs=K5ta8V%252BWhtbwdFgXKu1Oiw%3D%3D; Arrow Part Number: LS Q976-NR-1; Arrow Price/Stock: https://www.arrow.com/en/products/lsq976-nr-1/osram-opto-semiconductors?region=europe
IC5 = nPM1100-CAAA-E-R7: Integrated Circuit; Manufacturer_Name: Nordic Semiconductor; Datasheet Link: https://eu.mouser.com/datasheet/2/297/nPM1100_PS_v1_1-3074770.pdf; Height: 0.522mm; Manufacturer_Part_Number: nPM1100-CAAA-E-R7; Mouser Part Number: 949-NPM1100-CAAA-R7; Mouser Price/Stock: https://www.mouser.co.uk/ProductDetail/Nordic-Semiconductor/nPM1100-CAAA-E-R7?qs=vvQtp7zwQdOU6PwQjneJOA%3D%3D; Arrow Part Number: NPM1100-CAAA-E-R7; Arrow Price/Stock: https://www.arrow.com/en/products/npm1100-caaa-e-r7/nordic-semiconductor?region=nac
IC6 = MAX17224ELT+T: Integrated Circuit; Manufacturer_Name: Analog Devices; Datasheet Link: https://www.analog.com/MAX17224/datasheet; Height: 0.8mm; Manufacturer_Part_Number: MAX17224ELT+T; Mouser Part Number: 700-MAX17224ELT+T; Mouser Price/Stock: https://www.mouser.co.uk/ProductDetail/Maxim-Integrated/MAX17224ELT%2bT?qs=BZBei1rCqCCCW5323eMGwQ%3D%3D; Arrow Part Number: MAX17224ELT+T; Arrow Price/Stock: https://www.arrow.com/en/products/max17224eltt/maxim-integrated?region=nac
L1 = DFE201210U-2R2M=P2: Inductor; Manufacturer_Name: Murata Electronics; Datasheet Link: https://psearch.en.murata.com/inductor/product/DFE201210U-2R2M%23.html; Height: 1mm; Manufacturer_Part_Number: DFE201210U-2R2M=P2; Mouser Part Number: 81-DFE201210U-2R2MP2; Mouser Price/Stock: https://www.mouser.co.uk/ProductDetail/Murata-Electronics/DFE201210U-2R2M%3dP2?qs=AQlKX63v8Rt%252B2GxwUyA5Fw%3D%3D; Arrow Part Number: DFE201210U-2R2M=P2; Arrow Price/Stock: https://www.arrow.com/en/products/dfe201210u-2r2mp2/murata-manufacturing?region=nac
L2 = LQM2HPN2R2MJ0L: Inductor; Manufacturer_Name: Murata Electronics; Datasheet Link: https://psearch.en.murata.com/inductor/product/LQM2HPN2R2MJ0%23.html; Height: 1.2mm; Manufacturer_Part_Number: LQM2HPN2R2MJ0L; Mouser Part Number: 81-LQM2HPN2R2MJ0L; Mouser Price/Stock: https://www.mouser.co.uk/ProductDetail/Murata-Electronics/LQM2HPN2R2MJ0L?qs=%2F%252BYoplLUB5gah%2Fy6io9rJg%3D%3D; Arrow Part Number: LQM2HPN2R2MJ0L; Arrow Price/Stock: https://www.arrow.com/en/products/lqm2hpn2r2mj0l/murata-manufacturing?region=nac
Q2 = DMC2400UV: Transistor; Manufacturer_Name: Diodes Incorporated; Datasheet Link: https://www.diodes.com/assets/Datasheets/DMC2400UV.pdf; Height: 0.6mm; Manufacturer_Part_Number: DMC2400UV; Mouser Part Number: N/A; Mouser Price/Stock: https://www.mouser.co.uk/ProductDetail/Diodes-Incorporated/DMC2400UV?qs=Wj%2FVkw3K%252BMA7RIsKQCzONw%3D%3D
Q3 = FDV303N: MOSFET (N-Channel); Manufacturer_Name: onsemi; Datasheet Link: https://www.onsemi.com/pub/Collateral/FDV303N-D.PDF; Height: 1.11mm; Manufacturer_Part_Number: FDV303N; Mouser Part Number: 512-FDV303N; Mouser Price/Stock: https://www.mouser.co.uk/ProductDetail/onsemi-Fairchild/FDV303N?qs=FOlmdCx%252BAA1IyXspysHTkA%3D%3D; Arrow Part Number: FDV303N; Arrow Price/Stock: https://www.arrow.com/en/products/fdv303n/on-semiconductor?region=europe
R13 = RC0603FR-0716K2L: Resistor; Manufacturer_Name: KEMET; Datasheet Link: http://www.yageo.com/documents/recent/PYu-RC0603_51_RoHS_L_v5.pdf; Height: 0.55mm; Manufacturer_Part_Number: RC0603FR-0716K2L; Mouser Part Number: 603-RC0603FR-0716K2L; Mouser Price/Stock: https://www.mouser.co.uk/ProductDetail/Yageo/RC0603FR-0716K2L?qs=VU8sRB4EgwBbyU4POY2x9w%3D%3D
R14 = HMC0402JT33M0: Resistor; Manufacturer_Name: Stackpole Electronics; Datasheet Link: https://cs.seielect.com/catalog/SEI-HMC.pdf; Height: 0.4mm; Manufacturer_Part_Number: HMC0402JT33M0; Arrow Part Number: HMC0402JT33M0; Arrow Price/Stock: https://www.arrow.com/en/products/hmc0402jt33m0/stackpole-electronics
R15 R18 R19 = ERJ-3EKF1004V: Resistor; Manufacturer_Name: Panasonic; Datasheet Link: http://industrial.panasonic.com/cdbs/www-data/pdf/RDA0000/AOA0000C86.pdf; Height: 0.55mm; Manufacturer_Part_Number: ERJ-3EKF1004V; Mouser Part Number: 667-ERJ-3EKF1004V; Mouser Price/Stock: https://www.mouser.co.uk/ProductDetail/Panasonic/ERJ-3EKF1004V?qs=6%252BUraArZVSCwybhfQn7iYg%3D%3D; Arrow Part Number: ERJ-3EKF1004V; Arrow Price/Stock: https://www.arrow.com/en/products/erj-3ekf1004v/panasonic?region=nac
R16 = ERJ-2RKF1500X: Resistor; Manufacturer_Name: Panasonic; Datasheet Link: https://industrial.panasonic.com/cdbs/www-data/pdf/RDA0000/AOA0000C86.pdf; Height: 0.4mm; Manufacturer_Part_Number: ERJ-2RKF1500X; Mouser Part Number: 667-ERJ-2RKF1500X; Mouser Price/Stock: https://www.mouser.co.uk/ProductDetail/Panasonic/ERJ-2RKF1500X?qs=MVjVSMjNRMocymBqQ7AAtQ%3D%3D; Arrow Part Number: ERJ-2RKF1500X; Arrow Price/Stock: https://www.arrow.com/en/products/erj-2rkf1500x/panasonic?region=nac
R17 = ERJ-2GEJ155X: Resistor; Manufacturer_Name: Panasonic; Datasheet Link: https://datasheet.datasheetarchive.com/originals/distributors/DKDS40/DSANUWW0010593.pdf; Height: 0.4mm; Manufacturer_Part_Number: ERJ-2GEJ155X; Mouser Part Number: 667-ERJ-2GEJ155X; Mouser Price/Stock: https://www.mouser.co.uk/ProductDetail/Panasonic/ERJ-2GEJ155X?qs=MVjVSMjNRMoBrgcCxtyHNA%3D%3D
R20 = ERJ-2GEJ224X: Resistor; Manufacturer_Name: Panasonic; Datasheet Link: https://datasheet.datasheetarchive.com/originals/distributors/DKDS40/DSANUWW0010623.pdf; Height: 0.4mm; Manufacturer_Part_Number: ERJ-2GEJ224X; Mouser Part Number: 667-ERJ-2GEJ224X; Mouser Price/Stock: https://www.mouser.co.uk/ProductDetail/Panasonic/ERJ-2GEJ224X?qs=H7k1u0Mp9JQ0o1uy9bJkFg%3D%3D; Arrow Part Number: ERJ-2GEJ224X; Arrow Price/Stock: https://www.arrow.com/en/products/erj2gej224x/panasonic?region=nac
RT1 = ERT-JZEG103FA: NTC Thermistor 10k 0201 (0603 Metric); Manufacturer_Name: Panasonic; Datasheet Link: https://industrial.panasonic.com/cdbs/www-data/pdf/AUA0000/AUA0000C8.pdf; Height: 0.33mm; Manufacturer_Part_Number: ERT-JZEG103FA; Mouser Part Number: 667-ERT-JZEG103FA; Mouser Price/Stock: https://www.mouser.co.uk/ProductDetail/Panasonic/ERT-JZEG103FA?qs=8rMlxy%252BA7jnazXT5AW8efg%3D%3D; Arrow Part Number: ERT-JZEG103FA; Arrow Price/Stock: https://www.arrow.com/en/products/ert-jzeg103fa/panasonic?region=nac
S1 = 450404015514: Switch; Manufacturer_Name: Wurth Elektronik; Datasheet Link: https://katalog.we-online.de/em/datasheet/450404015514.pdf; Height: 1.4mm; Manufacturer_Part_Number: 450404015514; Mouser Part Number: 710-450404015514; Mouser Price/Stock: https://www.mouser.co.uk/ProductDetail/Wurth-Elektronik/450404015514?qs=sPbYRqrBIVk21%2FxsES2IZA%3D%3D
VBAT = TP_SMD_Ø1.0MM: as A0 on sheet sensors; Part Number: TP_SMD_Ø1.0MM; LatestRevisionDate: 2021-03-05; Pin Count: 1; Publisher: Nordic Semiconductor; Published: 2013-06-11; Value: Ø1.0mm,SMD; Note: N.A.; Artikkelnr Noca: N.A.; Footprint Doc: TP_SMD_Ø1.0mm; Part number IPS: N.A.; ComponentLink1URL: N.A.; ComponentLink1Description: Datasheet; ComponentLink2URL: N.A.; ComponentLink2Description: Supplier link; HelpURL: N.A.; Supplier 1: N.A.; Supplier Part Number 1: N.A.; Supplier 2: N.A.; Supplier Part Number 2: N.A.; Author: rsk; Component Class: Connectors; PartId: 100500475; Part number Norautron: N.A.

## Nets that join several sheets
GND: sensors (56 pins), power_supply (24 pins)
VDD: sensors (25 pins), power_supply (6 pins)
VLED: sensors (11 pins), power_supply (C45.2 IC6.1 SB15.2)